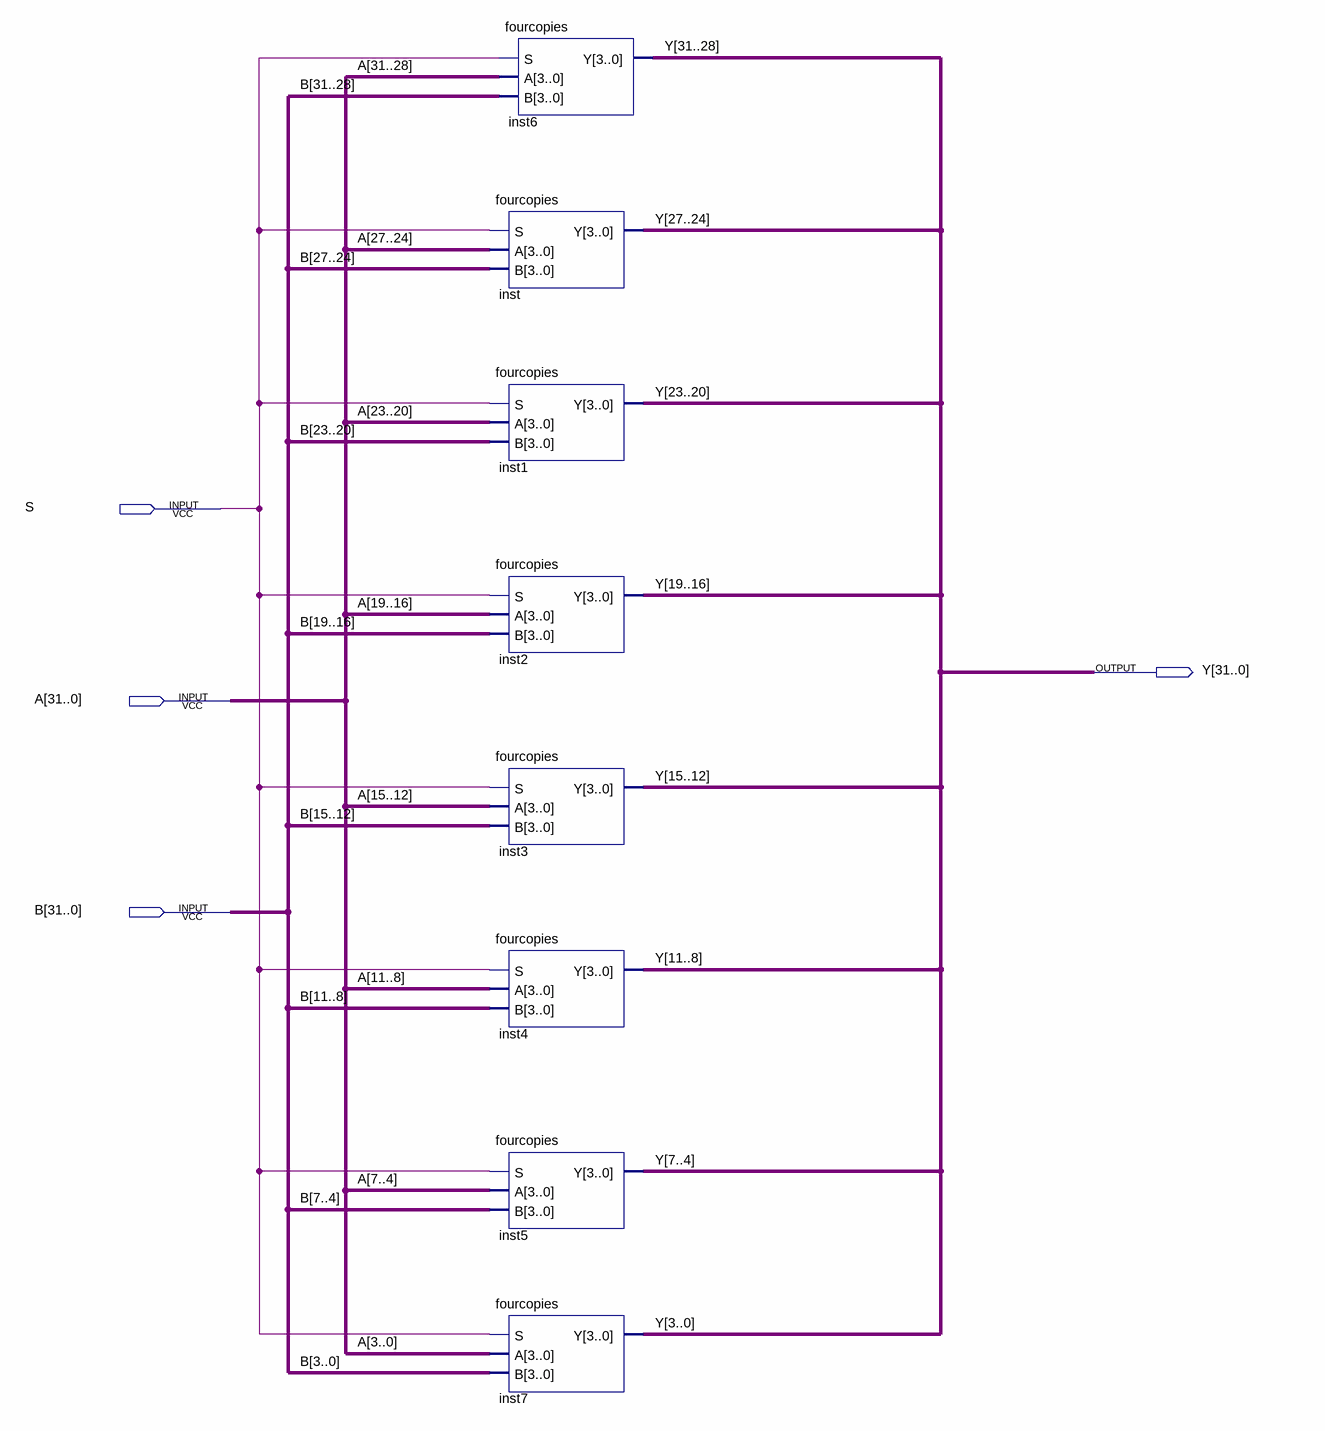
[diagram p0: schematic sheet]
// Quartus schematic thirtytwo.bdf as structural Verilog: 8 symbols, 4 pins
module thirtytwo (
  input  S,
  input  [31:0] A,
  input  [31:0] B,
  output [31:0] Y
);

  fourcopies inst6 (.S(S), .A(A[31:28]), .B(B[31:28]), .Y(Y[31:28]));
  fourcopies inst (.S(S), .A(A[27:24]), .B(B[27:24]), .Y(Y[27:24]));
  fourcopies inst1 (.S(S), .A(A[23:20]), .B(B[23:20]), .Y(Y[23:20]));
  fourcopies inst2 (.S(S), .A(A[19:16]), .B(B[19:16]), .Y(Y[19:16]));
  fourcopies inst3 (.S(S), .A(A[15:12]), .B(B[15:12]), .Y(Y[15:12]));
  fourcopies inst4 (.S(S), .A(A[11:8]), .B(B[11:8]), .Y(Y[11:8]));
  fourcopies inst5 (.S(S), .A(A[7:4]), .B(B[7:4]), .Y(Y[7:4]));
  fourcopies inst7 (.S(S), .A(A[3:0]), .B(B[3:0]), .Y(Y[3:0]));
endmodule
